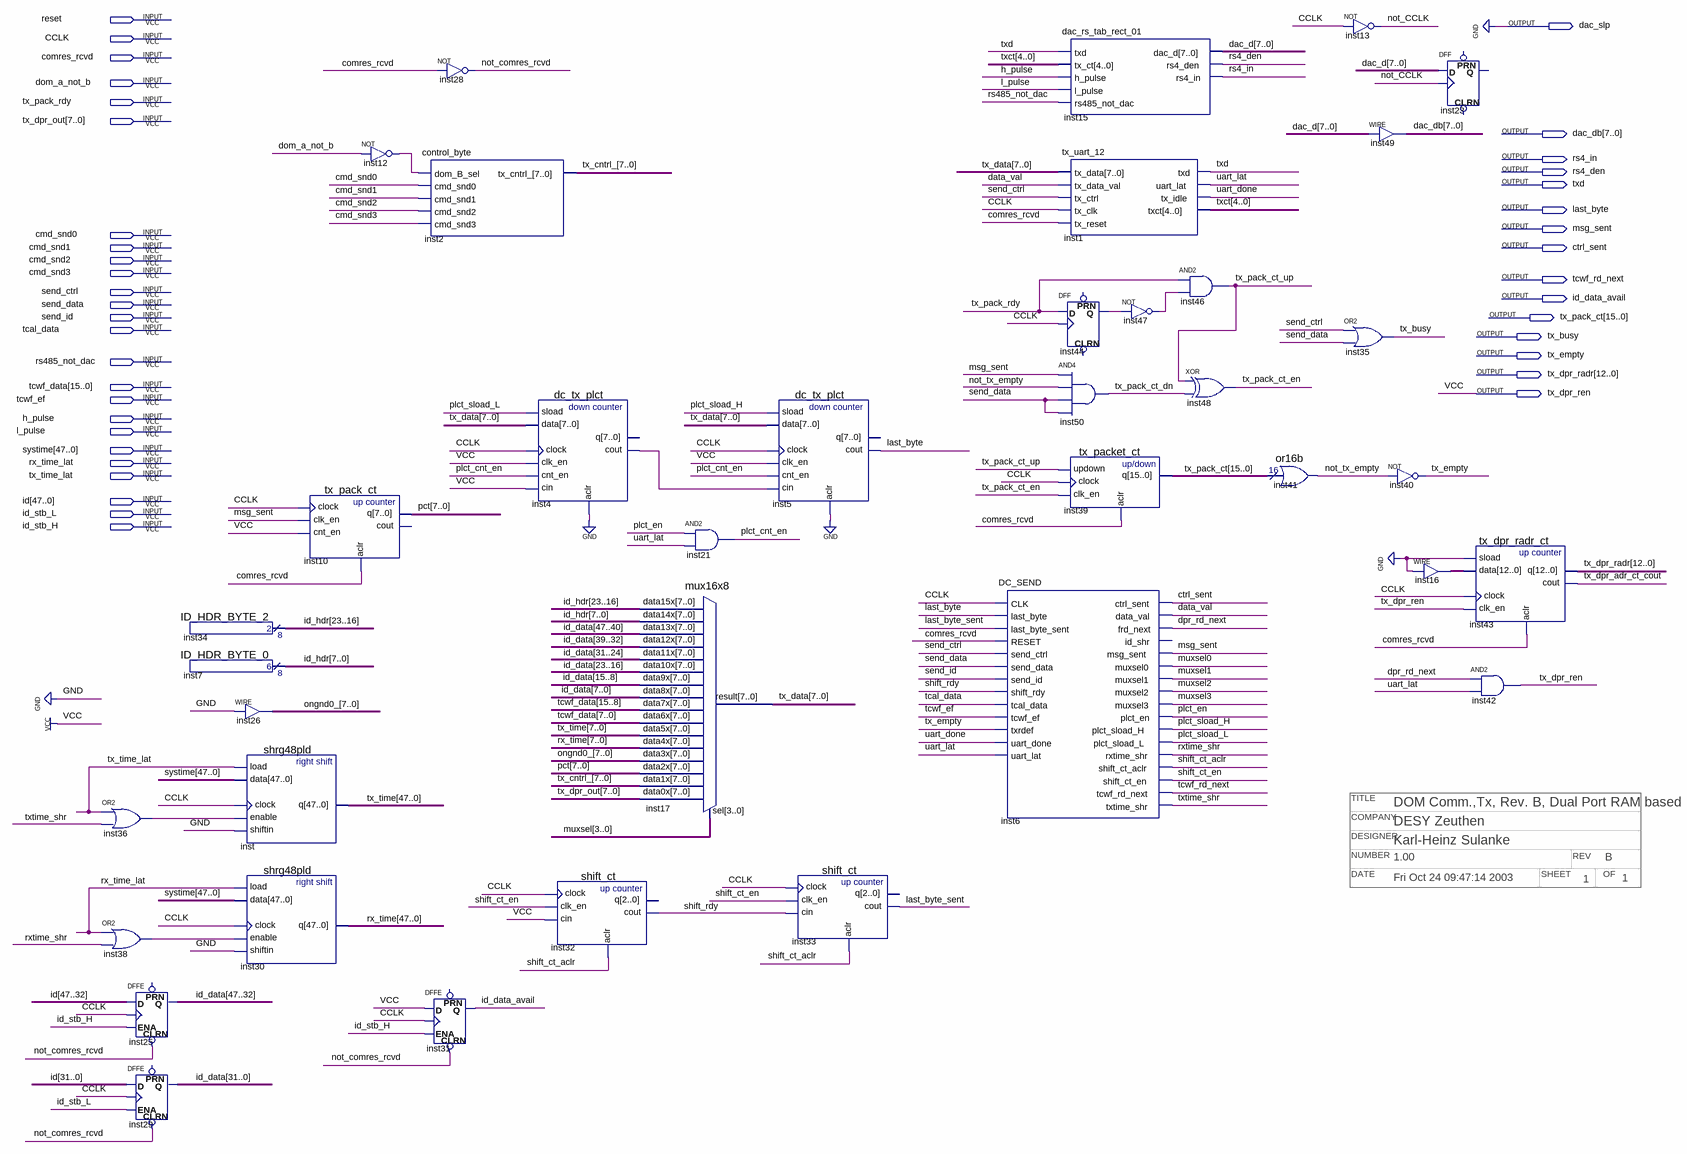
[diagram p0: schematic sheet]
// Quartus schematic DC_Tx_chan_dpr.bdf as structural Verilog: 38 symbols, 40 pins
// Title block: TITLE: DOM Comm.,Tx, Rev. B, Dual Port RAM based; COMPANY: DESY Zeuthen; DESIGNER: Karl-Heinz Sulanke; NUMBER: 1.00; REV: B; DATE: Fri Oct 24 09:47:14 2003; SHEET: 1; OF: 1
module DC_Tx_chan_dpr (
  input  reset,
  input  CCLK,
  input  comres_rcvd,
  input  dom_a_not_b,
  input  tx_pack_rdy,
  input  [7:0] tx_dpr_out,
  input  cmd_snd0,
  input  cmd_snd1,
  input  cmd_snd2,
  input  cmd_snd3,
  input  send_ctrl,
  input  send_data,
  input  send_id,
  input  tcal_data,
  input  rs485_not_dac,
  input  [15:0] tcwf_data,
  input  tcwf_ef,
  input  h_pulse,
  input  l_pulse,
  input  [47:0] systime,
  input  rx_time_lat,
  input  tx_time_lat,
  input  [47:0] id,
  input  id_stb_L,
  input  id_stb_H,
  output dac_slp,
  output [7:0] dac_db,
  output rs4_in,
  output rs4_den,
  output txd,
  output last_byte,
  output msg_sent,
  output ctrl_sent,
  output tcwf_rd_next,
  output id_data_avail,
  output [15:0] tx_pack_ct,
  output tx_busy,
  output tx_empty,
  output [12:0] tx_dpr_radr,
  output tx_dpr_ren
);

  wire data_val, dpr_rd_next, inst4_cout, inst12_out, inst36_out, inst38_out, inst44_q, inst47_out,
       last_byte_sent, not_CCLK, not_comres_rcvd, not_tx_empty, plct_cnt_en, plct_en, plct_sload_H,
       plct_sload_L, rxtime_shr, shift_ct_aclr, shift_ct_en, shift_rdy, tx_dpr_adr_ct_cout, tx_pack_ct_dn,
       tx_pack_ct_en, tx_pack_ct_up, txtime_shr, uart_done, uart_lat;
  wire [3:0] muxsel;
  wire [4:0] txct;
  wire [7:0] dac_d, ongnd0_, pct, tx_cntrl_, tx_data;
  wire [12:0] inst16_out;
  wire [23:0] id_hdr;
  wire [47:0] id_data, rx_time, tx_time;

  or inst36 (inst36_out, tx_time_lat, txtime_shr);
  or inst38 (inst38_out, rx_time_lat, rxtime_shr);
  DFFE inst25[15:0] (
    .CLRN(not_comres_rcvd), .D(id[47:32]), .CLK(CCLK), .ENA(id_stb_H), .Q(id_data[47:32]));  // open: PRN
  DFFE inst29[31:0] (.CLRN(not_comres_rcvd), .D(id[31:0]), .CLK(CCLK), .ENA(id_stb_L), .Q(id_data[31:0]));  // open: PRN
  ID_HDR_BYTE_2 inst34 (.result(id_hdr[23:16]));
  ID_HDR_BYTE_0 inst7 (.result(id_hdr[7:0]));
  assign ongnd0_ = {8{1'b0}};  // WIRE inst26
  shrg48pld inst (.load(tx_time_lat), .data(systime), .clock(CCLK), .enable(inst36_out), .shiftin(1'b0), .q(tx_time));
  shrg48pld inst30 (.load(rx_time_lat), .data(systime), .clock(CCLK), .enable(inst38_out), .shiftin(1'b0), .q(rx_time));
  tx_pack_ct inst10 (.clock(CCLK), .clk_en(msg_sent), .cnt_en(tx_dpr_ren), .aclr(comres_rcvd), .q(pct));  // open: cout
  not inst12 (inst12_out, dom_a_not_b);
  control_byte inst2 (
    .dom_B_sel(inst12_out), .cmd_snd0(cmd_snd0), .cmd_snd1(cmd_snd1), .cmd_snd2(cmd_snd2),
    .cmd_snd3(cmd_snd3), .tx_cntrl_(tx_cntrl_));
  DFFE inst31 (.CLRN(not_comres_rcvd), .D(tx_dpr_ren), .CLK(CCLK), .ENA(id_stb_H), .Q(id_data_avail));  // open: PRN
  not inst28 (not_comres_rcvd, comres_rcvd);
  dc_tx_plct inst4 (
    .sload(plct_sload_L), .data(tx_data), .clock(CCLK), .clk_en(tx_dpr_ren), .cnt_en(plct_cnt_en),
    .cin(tx_dpr_ren), .aclr(1'b0), .cout(inst4_cout));  // open: q
  shift_ct inst32 (
    .clock(CCLK), .clk_en(shift_ct_en), .cin(tx_dpr_ren), .aclr(shift_ct_aclr), .cout(shift_rdy));  // open: q
  mux16x8 inst17 (
    .data15x(id_hdr[23:16]), .data14x(id_hdr[7:0]), .data13x(id_data[47:40]), .data12x(id_data[39:32]),
    .data11x(id_data[31:24]), .data10x(id_data[23:16]), .data9x(id_data[15:8]), .data8x(id_data[7:0]),
    .data7x(tcwf_data[15:8]), .data6x(tcwf_data[7:0]), .data5x(tx_time[7:0]), .data4x(rx_time[7:0]),
    .data3x(ongnd0_), .data2x(pct), .data1x(tx_cntrl_), .data0x(tx_dpr_out), .sel(muxsel), .result(tx_data));
  and inst21 (plct_cnt_en, plct_en, uart_lat);
  dc_tx_plct inst5 (
    .sload(plct_sload_H), .data(tx_data), .clock(CCLK), .clk_en(tx_dpr_ren), .cnt_en(plct_cnt_en),
    .cin(inst4_cout), .aclr(1'b0), .cout(last_byte));  // open: q
  shift_ct inst33 (
    .clock(CCLK), .clk_en(shift_ct_en), .cin(shift_rdy), .aclr(shift_ct_aclr), .cout(last_byte_sent));  // open: q
  DC_SEND inst6 (
    .CLK(CCLK), .last_byte(last_byte), .last_byte_sent(last_byte_sent), .RESET(comres_rcvd),
    .send_ctrl(send_ctrl), .send_data(send_data), .send_id(send_id), .shift_rdy(shift_rdy),
    .tcal_data(tcal_data), .tcwf_ef(tcwf_ef), .txrdef(tx_empty), .uart_done(uart_done), .uart_lat(uart_lat),
    .ctrl_sent(ctrl_sent), .data_val(data_val), .frd_next(dpr_rd_next), .msg_sent(msg_sent),
    .muxsel0(muxsel[0]), .muxsel1(muxsel[1]), .muxsel2(muxsel[2]), .muxsel3(muxsel[3]), .plct_en(plct_en),
    .plct_sload_H(plct_sload_H), .plct_sload_L(plct_sload_L), .rxtime_shr(rxtime_shr),
    .shift_ct_aclr(shift_ct_aclr), .shift_ct_en(shift_ct_en), .tcwf_rd_next(tcwf_rd_next),
    .txtime_shr(txtime_shr));  // open: id_shr
  dac_rs_tab_rect_01 inst15 (
    .txd(txd), .tx_ct(txct), .h_pulse(h_pulse), .l_pulse(l_pulse), .rs485_not_dac(rs485_not_dac),
    .dac_d(dac_d), .rs4_den(rs4_den), .rs4_in(rs4_in));
  tx_uart_12 inst1 (
    .tx_data(tx_data), .tx_data_val(data_val), .tx_ctrl(send_ctrl), .tx_clk(CCLK), .tx_reset(comres_rcvd),
    .txd(txd), .uart_lat(uart_lat), .tx_idle(uart_done), .txct(txct));
  DFF inst44 (.CLK(CCLK), .D(tx_pack_rdy), .Q(inst44_q));  // open: CLRN, PRN
  and inst50 (tx_pack_ct_dn, msg_sent, not_tx_empty, send_data, send_data);
  tx_packet_ct inst39 (
    .updown(tx_pack_ct_up), .clock(CCLK), .clk_en(tx_pack_ct_en), .aclr(comres_rcvd), .q(tx_pack_ct));
  not inst47 (inst47_out, inst44_q);
  and inst46 (tx_pack_ct_up, tx_pack_rdy, inst47_out);
  xor inst48 (tx_pack_ct_en, tx_pack_ct_up, tx_pack_ct_dn);
  or16b inst41 (.data(tx_pack_ct), .result(not_tx_empty));
  not inst13 (not_CCLK, CCLK);
  assign dac_db = dac_d;  // WIRE inst49
  or inst35 (tx_busy, send_ctrl, send_data);
  not inst40 (tx_empty, not_tx_empty);
  DFF inst23[7:0] (.CLK(not_CCLK), .D(dac_d));  // open: CLRN, PRN, Q
  assign inst16_out = {13{1'b0}};  // WIRE inst16
  tx_dpr_radr_ct inst43 (
    .sload(1'b0), .data(inst16_out), .clock(CCLK), .clk_en(tx_dpr_ren), .aclr(comres_rcvd), .q(tx_dpr_radr),
    .cout(tx_dpr_adr_ct_cout));
  and inst42 (tx_dpr_ren, dpr_rd_next, uart_lat);

  assign dac_slp = 1'b0;
  // also tied to VCC on the sheet: tx_dpr_ren

  // Other names for the same wires on the sheet: VCC = tx_dpr_ren
endmodule
